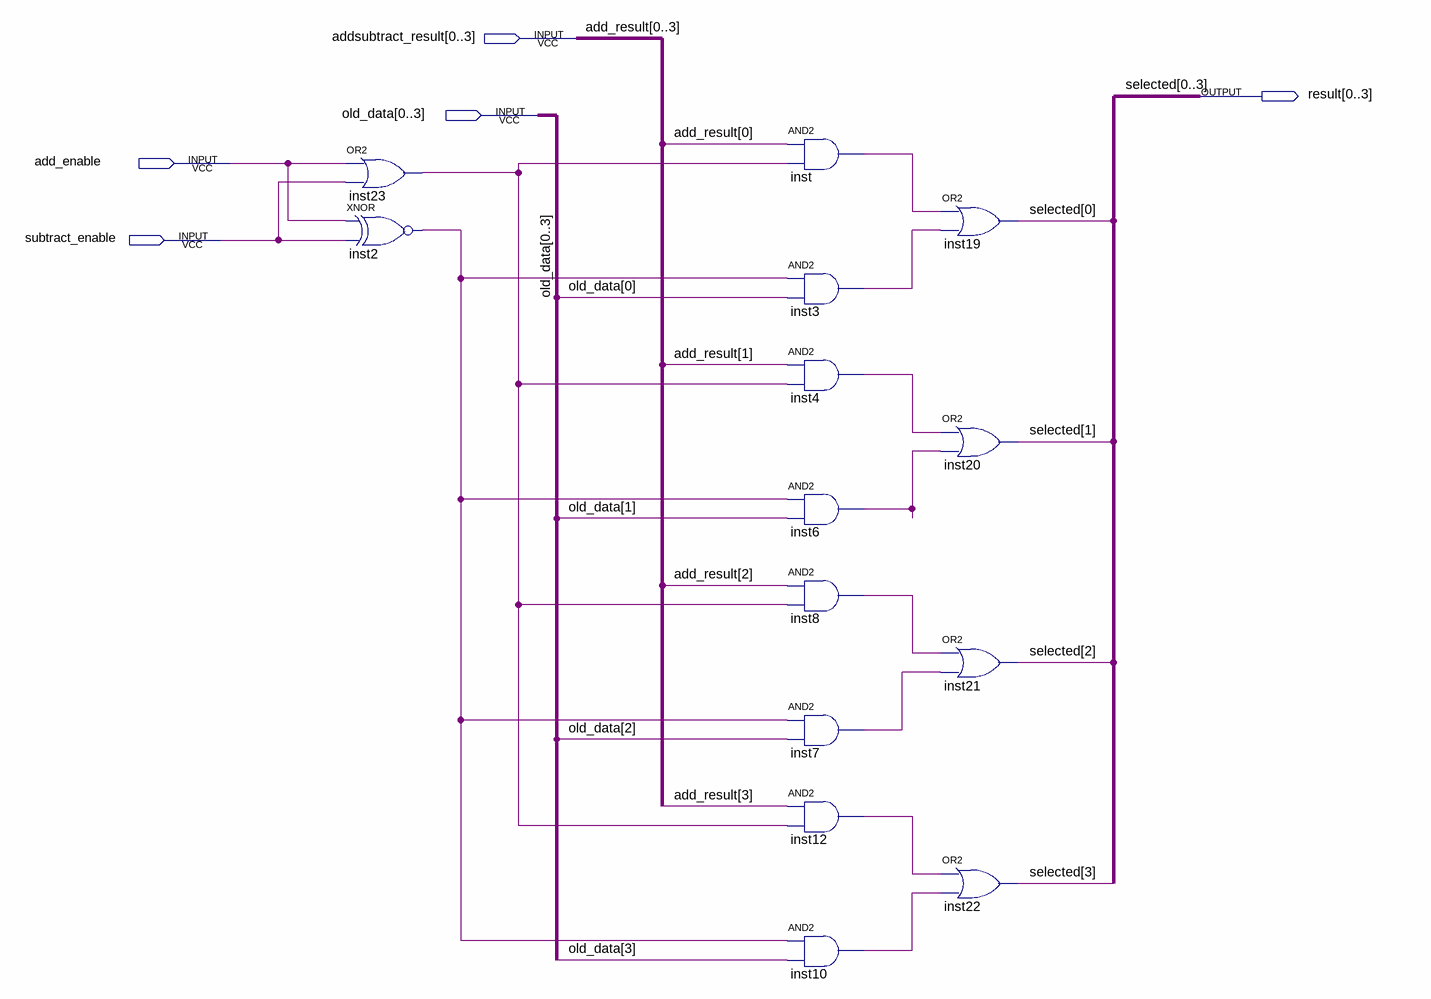
[diagram p0: schematic sheet]
// Quartus schematic add_subt_select.bdf as structural Verilog: 14 symbols, 5 pins
module add_subt_select (
  input  [0:3] addsubtract_result,
  input  [0:3] old_data,
  input  add_enable,
  input  subtract_enable,
  output [0:3] result
);

  wire inst2_out, inst3_out, inst4_out, inst6_out, inst7_out, inst8_out, inst10_out, inst12_out, inst23_out,
       inst_out;

  or inst23 (inst23_out, add_enable, subtract_enable);
  xnor inst2 (inst2_out, add_enable, subtract_enable);
  and inst (inst_out, addsubtract_result[0], inst23_out);
  and inst3 (inst3_out, inst2_out, old_data[0]);
  and inst4 (inst4_out, addsubtract_result[1], inst23_out);
  and inst6 (inst6_out, inst2_out, old_data[1]);
  and inst8 (inst8_out, addsubtract_result[2], inst23_out);
  and inst7 (inst7_out, inst2_out, old_data[2]);
  and inst12 (inst12_out, addsubtract_result[3], inst23_out);
  and inst10 (inst10_out, inst2_out, old_data[3]);
  or inst19 (result[0], inst_out, inst3_out);
  or inst20 (result[1], inst4_out, inst6_out);
  or inst21 (result[2], inst8_out, inst7_out);
  or inst22 (result[3], inst12_out, inst10_out);

  // Other names for the same wires on the sheet: add_result[3:0] = {addsubtract_result[3], addsubtract_result[2], addsubtract_result[1], addsubtract_result[0]};
  //   selected[3:0] = {result[3], result[2], result[1], result[0]}
endmodule
